# EAGLE design vusbtinyisp_through-hole (EAGLE 6.5.0)
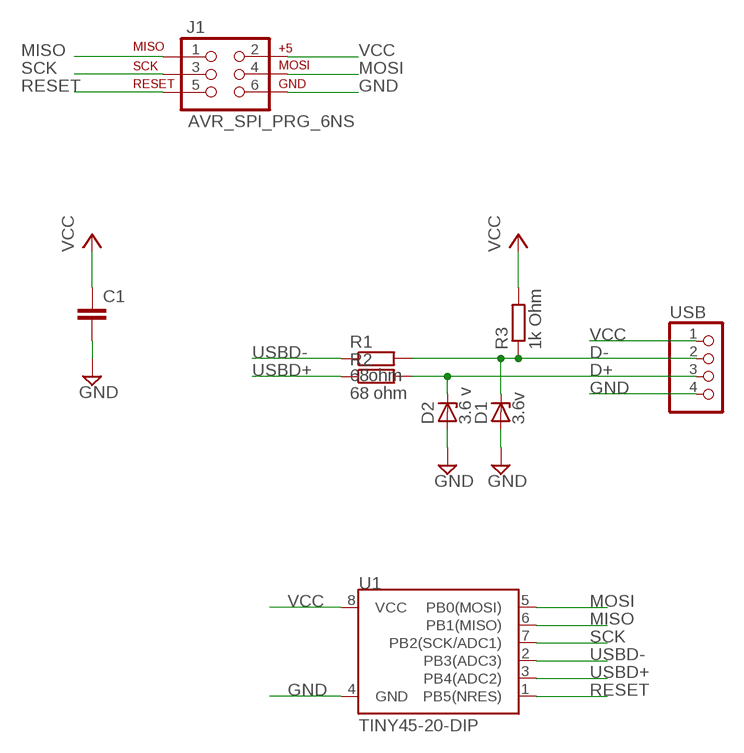
[diagram p0: schematic, sheet 1]

## Parts
C1  CAPPTH  [CAP-PTH-SMALL]
D1  3.6v  ZENER-DIODEDO35Z10  [DO35Z10]
D2  3.6 v  ZENER-DIODEDO35Z10  [DO35Z10]
J1  AVR_SPI_PRG_6NS  [2X3-NS]
R1  68ohm  R-EU_0207/10  [0207/10]
R2  68 ohm  R-EU_0207/10  [0207/10]
R3  1k Ohm  R-EU_0207/10  [0207/10]
U1  TINY45-20-DIP  ATTINY45TINY45-20-DIP  [DIP08]
USB  PINHD-1X4  [1X04]

## Nets
D+: D2.C R2.2 USB.3
D-: D1.C R1.2 R3.1 USB.2
GND: C1.2 D1.A D2.A J1.6 U1.4(GND) USB.4
MISO: J1.1 U1.6(PB1(MISO))
MOSI: J1.4 U1.5(PB0(MOSI))
RESET: J1.5 U1.1(PB5(NRES))
SCK: J1.3 U1.7(PB2(SCK/ADC1))
USBD+: R2.1 U1.3(PB4(ADC2))
USBD-: R1.1 U1.2(PB3(ADC3))
VCC: C1.1 J1.2 R3.2 U1.8(VCC) USB.1

## Library data of the parts
C1 = SparkFun-Passives:CAP: Capacitor Standard 0603 ceramic capacitor, and 0.1" leaded capacitor.
D1 D2 = diode:ZENER-DIODE: Z-Diode
J1 = SparkFun-Connectors:AVR_SPI_PRG_6: AVR ISP 6 Pin This is the reduced ISP connector for AVR programming. Common on Arduino. This footprint will take up less PCB space and can be used with a 10-pin to 6-pin adapter such as SKU: BOB-08508
R1-R3 = resistor:R-EU_: RESISTOR, European symbol
U1 = SparkFun-DigitalIC:ATTINY45: Atmel 8-pin 2/4/8kB flash uC; PROD_ID: IC-09439
USB = pinhead:PINHD-1X4: PIN HEADER

## Net classes
0 default: width 0.203 mm, clearance 0.152 mm

## Board
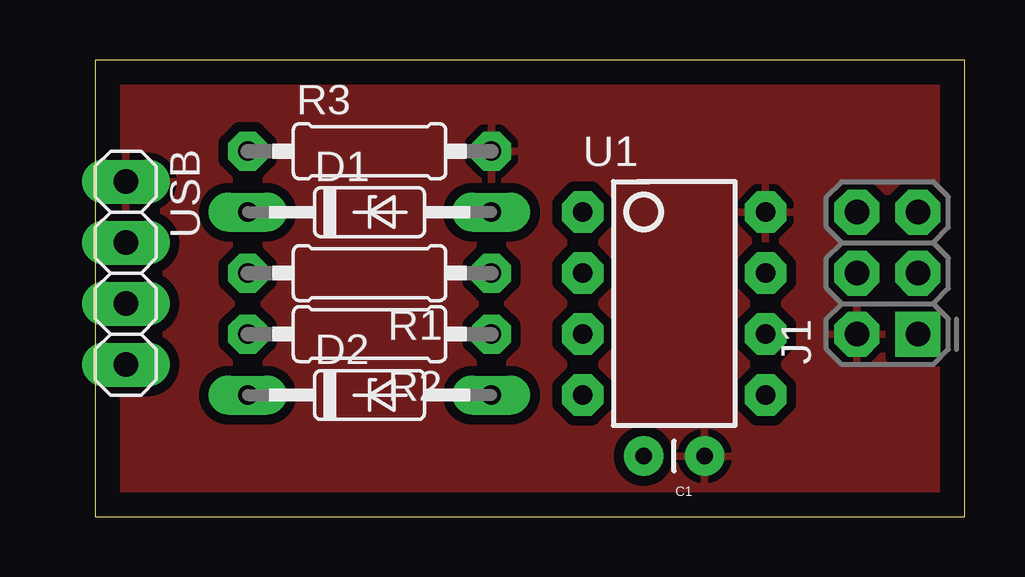
[diagram p1: board, top side]
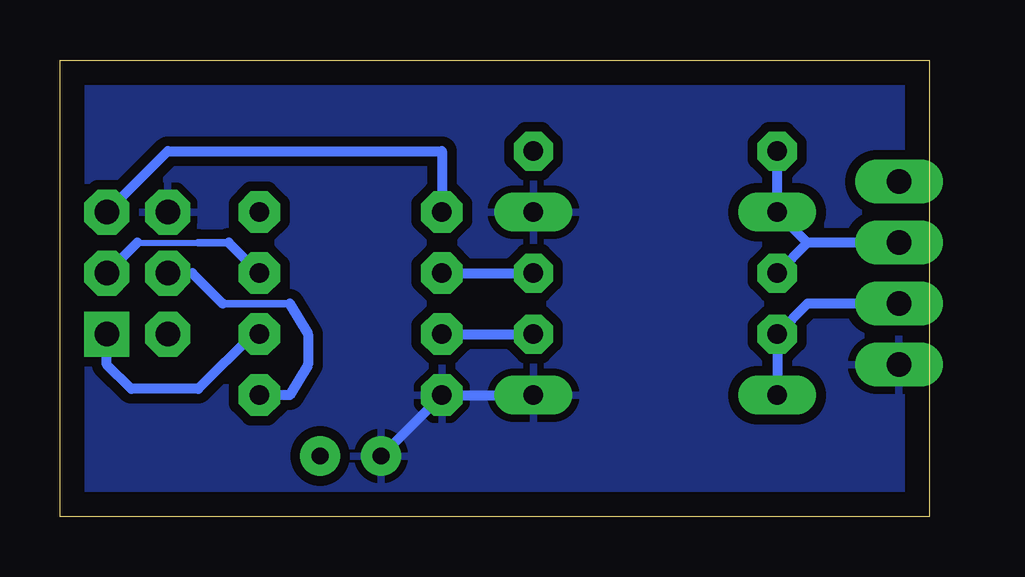
[diagram p2: board, bottom side, seen from below]

Size 36.25 x 19.04 mm. Coordinates in mm from the lower left corner, seen from the top.
Outline: 0,0 36.25,0 36.25,19.04 0,19.04 0,0
Copper layers (1*16): Top 0.035mm / dielectric 1.5mm / Bottom 0.035mm
Design rules "improved_12mil": minimum track width 12mil, minimum drill 0.8mm, track to track 12mil, track to pad 12mil, pad to pad 12mil, via to via 12mil, smd to smd 12mil, copper to edge 40mil, drill to drill 12mil, minimum pad ring 16mil, minimum via ring 16mil, stop-mask expansion 4mil, vias tented up to drill 0mil, thermal gap 12mil

### Footprints (pad centres in the part's own frame; a part is rotated, then mirrored left to right if it is on the bottom)
CAP-PTH-SMALL = drill 0.7 pad 1.651: 1 0,0; 2 2.54,0
DO35Z10 = drill 0.813 long: A 5.08,0; C -5.08,0
2X3-NS = drill 1.016 pad 1.88 square: 1 -2.54,-1.27 | drill 1.016 pad 1.88 octagon: 2 -2.54,1.27; 3 0,-1.27; 4 0,1.27; 5 2.54,-1.27; 6 2.54,1.27
0207/10 = drill 0.813 octagon: 1 -5.08,0; 2 5.08,0
DIP08 = drill 0.813 pad 1.727 octagon: 1 -3.81,-3.81; 2 -1.27,-3.81; 3 1.27,-3.81; 4 3.81,-3.81; 5 3.81,3.81; 6 1.27,3.81; 7 -1.27,3.81; 8 -3.81,3.81
1X04 = drill 1.016 long: 1 -3.81,0; 2 -1.27,0; 3 1.27,0; 4 3.81,0

### Placement (x,y rotation side)
C1  25.4,2.54 180 top
D1  11.43,12.7 0 top
D2  11.43,5.08 0 top
J1  33.02,10.16 90 top
R1  11.43,10.16 180 top
R2  11.43,7.62 180 top
R3  1.5k Ohm  [0207/10]  11.43,15.24 0 top
U1  24.13,8.89 270 top
USB  1.27,10.16 270 top

### Tracks (layer width: path | path; a pad name or v marks a point on that pad's centre or on a via)
D+
  Bottom 0.406: USB.3 5.08,8.89 R2.2 D2.C
D-
  Bottom 0.406: USB.2 5.08,11.43 | 5.08,11.43 R1.2 | 5.08,11.43 D1.C R3.1
GND
  Bottom 0.406: D2.A U1.4 C1.2
  pour Bottom (isolate 0.406): 0,20.32 0,0 36.83,0 36.83,20.32
MISO
  Bottom 0.406: U1.6 28.19,7.62 30.48,5.33 33.27,5.33 34.29,6.35 J1.1
MOSI
  Bottom 0.305: 29.46,8.89 26.67,8.89
  Bottom 0.406: J1.4 30.73,10.16 29.46,8.89 | 26.67,8.89 25.91,7.62 25.91,6.35 26.67,5.08 U1.5
RESET
  Bottom 0.406: U1.1 20.32,15.24 31.75,15.24 J1.5
SCK
  Bottom 0.254: 33.02,11.43 30.48,11.43
  Bottom 0.305: 30.48,11.43 29.21,11.43
  Bottom 0.406: J1.3 33.02,11.43 | 29.21,11.43 U1.7
USBD+
  Bottom 0.406: U1.3 R2.1
USBD-
  Bottom 0.406: U1.2 R1.1
VCC
  pour Top (isolate 0.406): 0,20.32 0,0 36.83,0 36.83,20.32

### Text on the board
Top: GND | VCC | VUSB Tiny